# EAGLE design esp8266-dev-board (EAGLE 7.3.0)

## Sheet 1 of 2
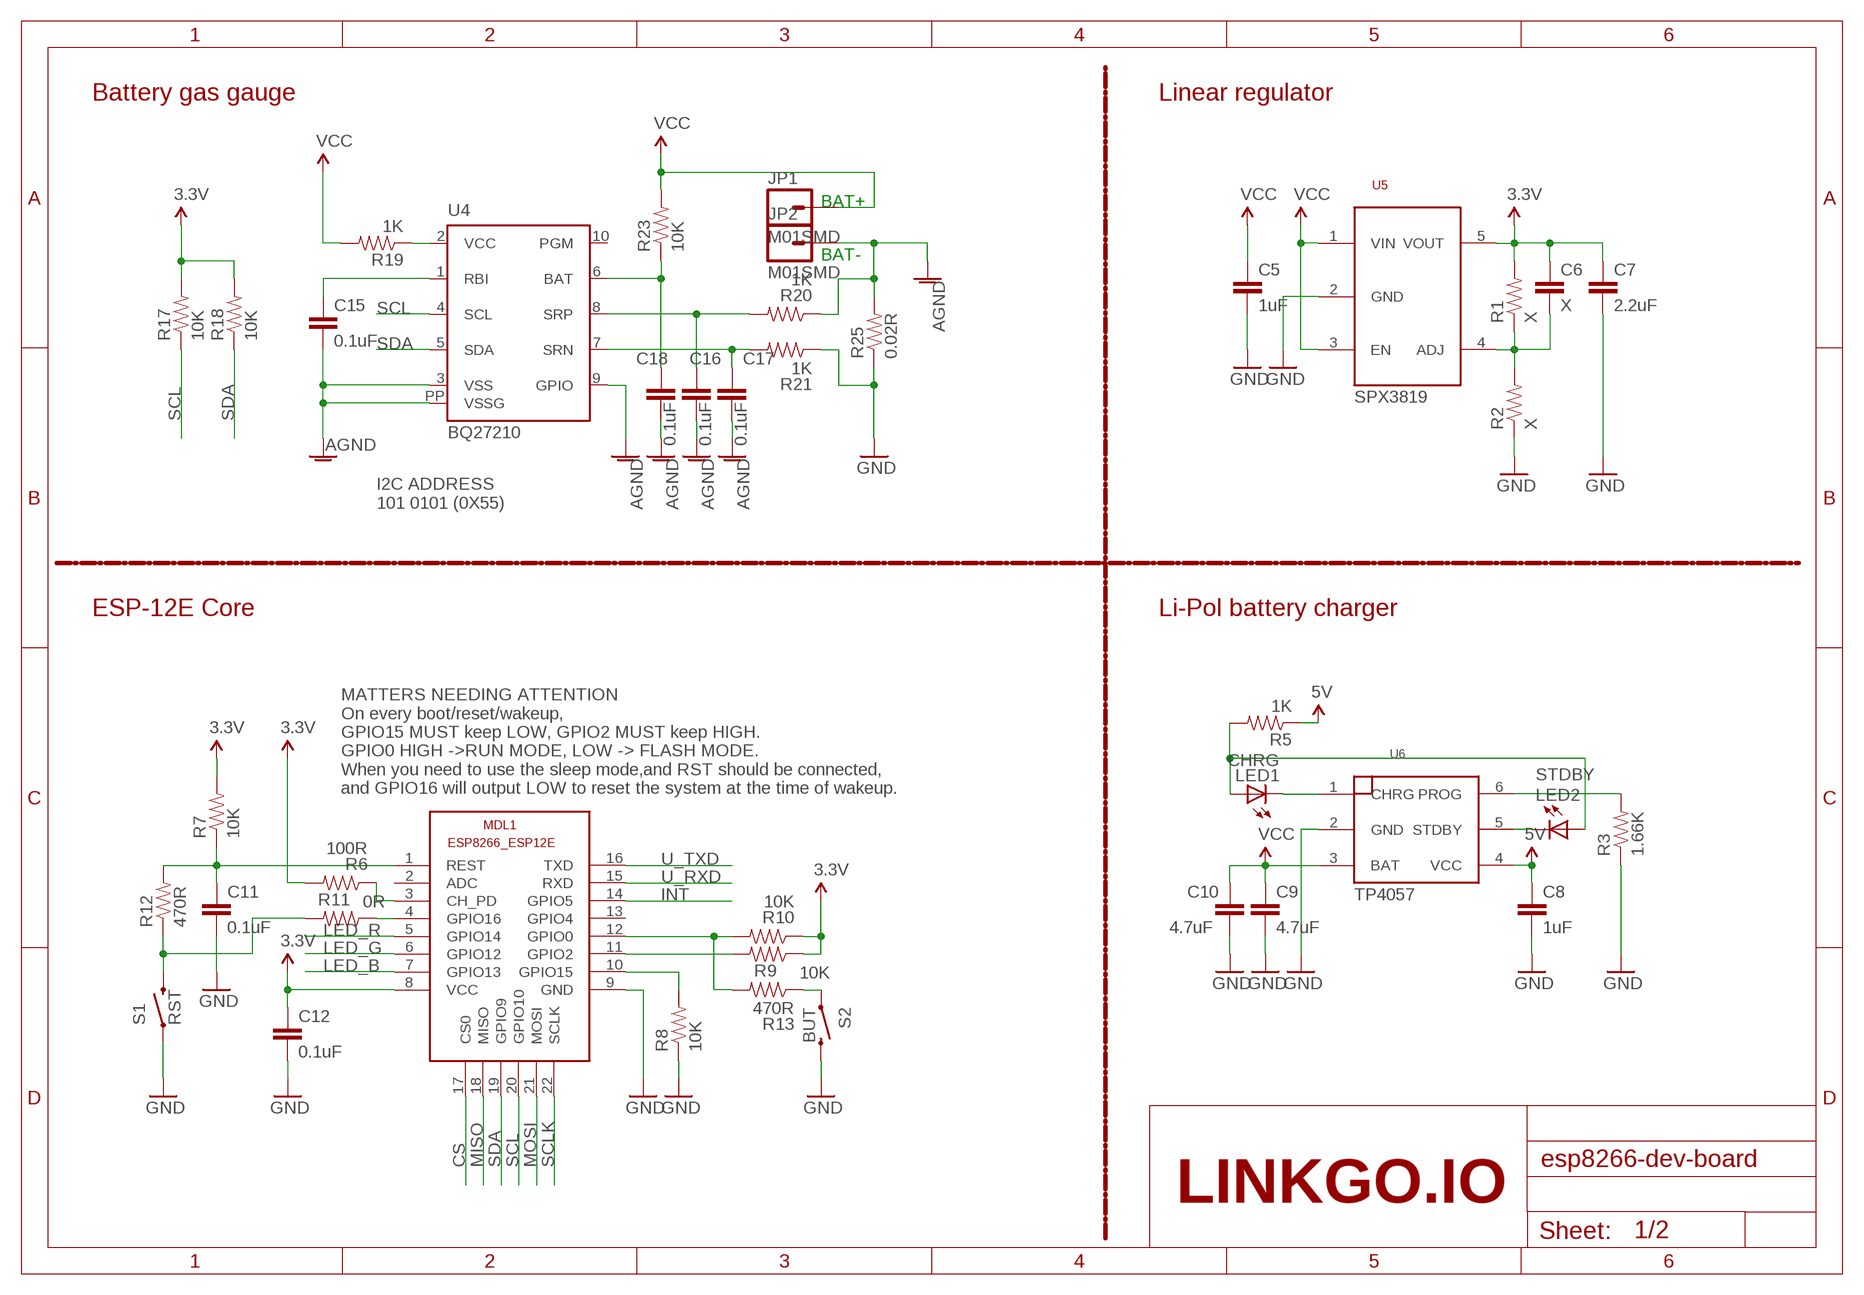
[diagram p0: schematic, sheet 1]

### Parts
C5  1uF  0.1UF-25V(+80/-20%)(0603)  [0603-CAP]
C6  X  0.1UF-25V(+80/-20%)(0603)  [0603-CAP]
C7  2.2uF  0.1UF-25V(+80/-20%)(0603)  [0603-CAP]
C8  1uF  0.1UF-25V(+80/-20%)(0603)  [0603-CAP]
C9  4.7uF  0.1UF-25V(+80/-20%)(0603)  [0603-CAP]
C10  4.7uF  0.1UF-25V(+80/-20%)(0603)  [0603-CAP]
C11  0.1uF  0.1UF-25V(+80/-20%)(0603)  [0603-CAP]
C12  0.1uF  0.1UF-25V(+80/-20%)(0603)  [0603-CAP]
C15  0.1uF  0.1UF-25V(+80/-20%)(0603)  [0603-CAP]
C16  0.1uF  0.1UF-25V(+80/-20%)(0603)  [0603-CAP]
C17  0.1uF  0.1UF-25V(+80/-20%)(0603)  [0603-CAP]
C18  0.1uF  0.1UF-25V(+80/-20%)(0603)  [0603-CAP]
JP1  M01SMD  [LUXEON-PAD]
JP2  M01SMD  [LUXEON-PAD]
LED1  CHRG  LED0603  [LED-0603]
LED2  STDBY  LED0603  [LED-0603]
MDL1  ESP8266-12EESP8266-ESP12E  [ESP8266-ESP12E]
R1  X  10KOHM-1/10W-1%(0603)0603  [0603-RES]
R2  X  10KOHM-1/10W-1%(0603)0603  [0603-RES]
R3  1.66K  10KOHM-1/10W-1%(0603)0603  [0603-RES]
R5  1K  10KOHM-1/10W-1%(0603)0603  [0603-RES]
R6  100R  10KOHM-1/10W-1%(0603)0603  [0603-RES]
R7  10K  10KOHM-1/10W-1%(0603)0603  [0603-RES]
R8  10K  10KOHM-1/10W-1%(0603)0603  [0603-RES]
R9  10K  10KOHM-1/10W-1%(0603)0603  [0603-RES]
R10  10K  10KOHM-1/10W-1%(0603)0603  [0603-RES]
R11  0R  10KOHM-1/10W-1%(0603)0603  [0603-RES]
R12  470R  10KOHM-1/10W-1%(0603)0603  [0603-RES]
R13  470R  10KOHM-1/10W-1%(0603)0603  [0603-RES]
R17  10K  10KOHM-1/10W-1%(0603)0603  [0603-RES]
R18  10K  10KOHM-1/10W-1%(0603)0603  [0603-RES]
R19  1K  10KOHM-1/10W-1%(0603)0603  [0603-RES]
R20  1K  10KOHM-1/10W-1%(0603)0603  [0603-RES]
R21  1K  10KOHM-1/10W-1%(0603)0603  [0603-RES]
R23  10K  10KOHM-1/10W-1%(0603)0603  [0603-RES]
R25  0.02R  RESISTOR1206  [1206]
S1  RST  SWITCH-MOMENTARY-2-SMD-1101NE  [TACTILE-SWITCH-1101NE]
S2  BUT  SWITCH-MOMENTARY-2-SMD-1101NE  [TACTILE-SWITCH-1101NE]
U4  BQ27210  [DRK_S-PDSO-N10]
U5  SPX3819M5-ADJ  [SOT23-5]
U6  TP4057  [SOT23-6]

### Nets
3.3V: C6.1 C7.1 C12.1 MDL1.8(VCC) R1.2 R6.2 R7.2 R9.1 R10.1 R17.2 R18.2 U5.5(VOUT) ; also sheet 2
5V: C8.1 R5.1 U6.4(VCC) ; also sheet 2
AGND: C15.2 C16.2 C17.2 C18.2 JP2.P$1 R20.1 R25.2 U4.3(VSS) U4.9(GPIO) U4.PP(VSSG)
CS: MDL1.17(CS0) ; also sheet 2
GND: C5.2 C7.2 C8.2 C9.2 C10.2 C11.2 C12.2 MDL1.9(GND) R2.1 R3.1 R8.1 R21.1 R25.1 S1.P$1 S2.P$2 U5.2(GND) U6.2(GND) ; also sheet 2
INT: MDL1.14(GPIO5) ; also sheet 2
LED_B: MDL1.7(GPIO13) ; also sheet 2
LED_G: MDL1.6(GPIO12) ; also sheet 2
LED_R: MDL1.5(GPIO14) ; also sheet 2
MISO: MDL1.18(MISO) ; also sheet 2
MOSI: MDL1.21(MOSI) ; also sheet 2
N$1: C6.2 R1.1 R2.2 U5.4(ADJ)
N$4: MDL1.10(GPIO15) R8.2
N$5: MDL1.12(GPIO0) R10.2 R13.2
N$6: LED1.A LED2.A R5.2
N$7: C11.1 MDL1.1(REST) R7.1 R12.2
N$8: LED1.C U6.1(CHRG)
N$9: LED2.C U6.5(STDBY)
N$10: R3.2 U6.6(PROG)
N$11: MDL1.3(CH_PD) R6.1
N$12: MDL1.11(GPIO2) R9.2
N$13: MDL1.4(GPIO16) R11.1
N$14: R11.2 R12.1 S1.P$2
N$15: R13.1 S2.P$1
N$20: C15.1 U4.1(RBI)
N$21: R19.1 U4.2(VCC)
N$22: C17.1 R21.2 U4.7(SRN)
N$23: C16.1 R20.2 U4.8(SRP)
N$26: C18.1 R23.1 U4.6(BAT)
SCL: MDL1.20(GPIO10) R17.1 U4.4(SCL) ; also sheet 2
SCLK: MDL1.22(SCLK) ; also sheet 2
SDA: MDL1.19(GPIO9) R18.1 U4.5(SDA) ; also sheet 2
U_RXD: MDL1.15(RXD) ; also sheet 2
U_TXD: MDL1.16(TXD) ; also sheet 2
VCC: C5.1 C9.1 C10.1 JP1.P$1 R19.2 R23.2 U5.1(VIN) U5.3(EN) U6.3(BAT)
Unconnected: MDL1.2(ADC) MDL1.13(GPIO4) U4.10(PGM)

### Notes on the sheet
- Battery gas gauge | Linear regulator
- BAT+
- BAT-
- SPX3819
- I2C ADDRESS
  101 0101 (0X55)
- ESP-12E Core | Li-Pol battery charger
- MATTERS NEEDING ATTENTION
  On every boot/reset/wakeup,
  GPIO15 MUST keep LOW, GPIO2 MUST keep HIGH.
  GPIO0 HIGH ->RUN MODE, LOW -> FLASH MODE.
  When you need to use the sleep mode,and RST should be connected, 
  and GPIO16 will output LOW to reset the system at the time of wakeup.
- TP4057
- LINKGO.IO

## Sheet 2 of 2
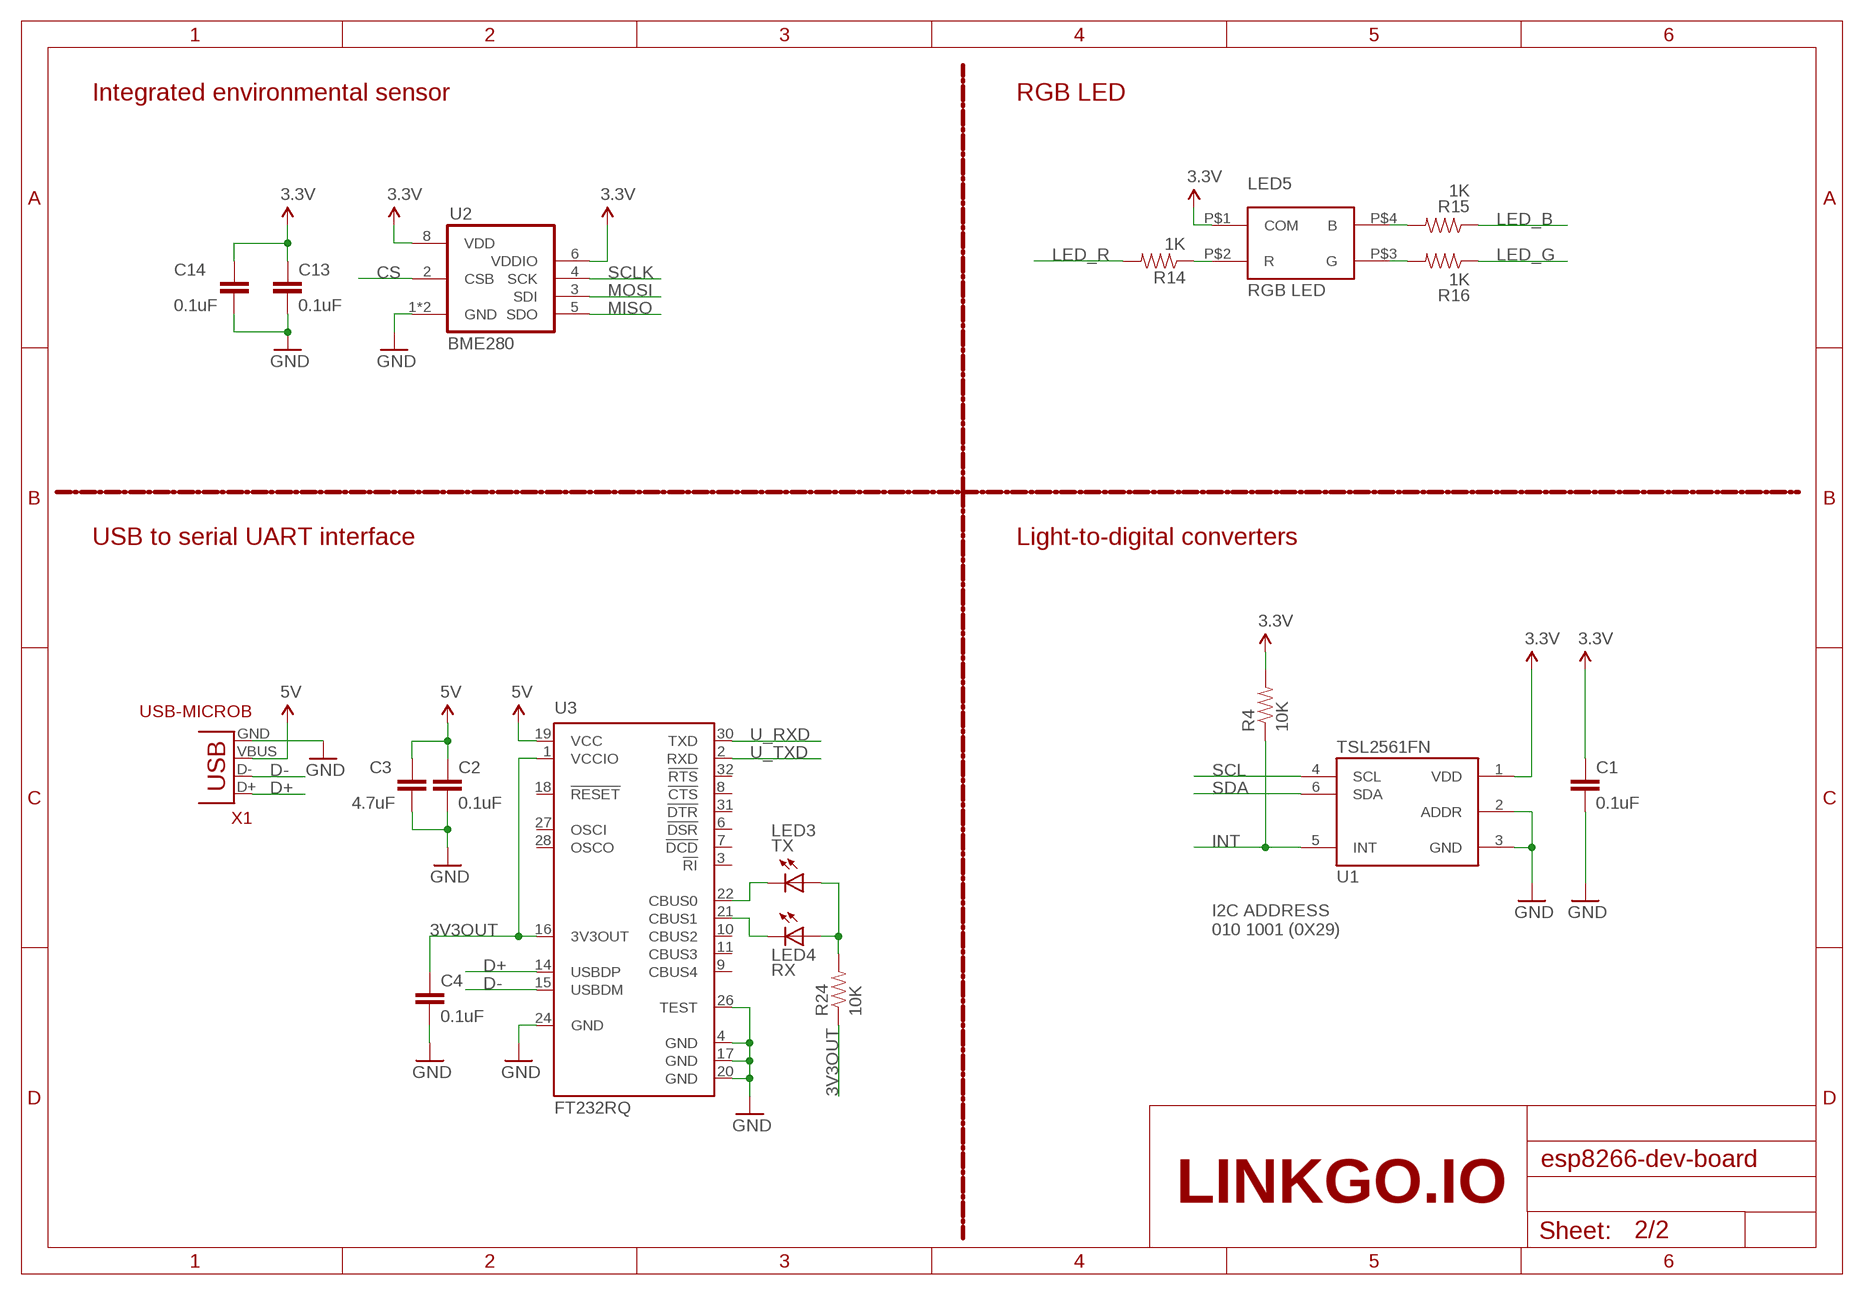
[diagram p1: schematic, sheet 2]

### Parts
C1  0.1uF  0.1UF-25V(+80/-20%)(0603)  [0603-CAP]
C2  0.1uF  0.1UF-25V(+80/-20%)(0603)  [0603-CAP]
C3  4.7uF  0.1UF-25V(+80/-20%)(0603)  [0603-CAP]
C4  0.1uF  0.1UF-25V(+80/-20%)(0603)  [0603-CAP]
C13  0.1uF  0.1UF-25V(+80/-20%)(0603)  [0603-CAP]
C14  0.1uF  0.1UF-25V(+80/-20%)(0603)  [0603-CAP]
LED3  TX  LED0603  [LED-0603]
LED4  RX  LED0603  [LED-0603]
LED5  0603RGB  [0603RGB]
R4  10K  10KOHM-1/10W-1%(0603)0603  [0603-RES]
R14  1K  10KOHM-1/10W-1%(0603)0603  [0603-RES]
R15  1K  10KOHM-1/10W-1%(0603)0603  [0603-RES]
R16  1K  10KOHM-1/10W-1%(0603)0603  [0603-RES]
R24  10K  10KOHM-1/10W-1%(0603)0603  [0603-RES]
U1  TSL2561FN  [FN-6]
U2  BME280  [BME280]
U3  FT232RQ  [QFN32]
X1  USB-MICROB  [USB-MICROB]

### Nets
3.3V: C1.1 C13.1 C14.1 LED5.P$1(COM) R4.2 U1.1(VDD) U2.6(VDDIO) U2.8(VDD) ; also sheet 1
3V3OUT: C4.1 R24.1 U3.1(VCCIO) U3.16(3V3OUT)
5V: C2.1 C3.1 U3.19(VCC) X1.VBUS ; also sheet 1
CS: U2.2(CSB) ; also sheet 1
D+: U3.14(USBDP) X1.D+
D-: U3.15(USBDM) X1.D-
GND: C1.2 C2.2 C3.2 C4.2 C13.2 C14.2 U1.2(ADDR) U1.3(GND) U2.1(GND) U2.7(GND) U3.4(GND) U3.17(GND) U3.20(GND) U3.24(GND) U3.26(TEST) X1.GND ; also sheet 1
INT: R4.1 U1.5(INT) ; also sheet 1
LED_B: R15.1 ; also sheet 1
LED_G: R16.1 ; also sheet 1
LED_R: R14.2 ; also sheet 1
MISO: U2.5(SDO) ; also sheet 1
MOSI: U2.3(SDI) ; also sheet 1
N$2: LED3.C U3.22(CBUS0)
N$3: LED4.C U3.21(CBUS1)
N$16: LED5.P$2(R) R14.1
N$17: LED5.P$4(B) R15.2
N$18: LED5.P$3(G) R16.2
N$19: LED3.A LED4.A R24.2
SCL: U1.4(SCL) ; also sheet 1
SCLK: U2.4(SCK) ; also sheet 1
SDA: U1.6(SDA) ; also sheet 1
U_RXD: U3.30(TXD) ; also sheet 1
U_TXD: U3.2(RXD) ; also sheet 1
Unconnected: U3.3(!RI) U3.6(!DSR) U3.7(!DCD) U3.8(!CTS) U3.9(CBUS4) U3.10(CBUS2) U3.11(CBUS3) U3.18(!RESET) U3.27(OSCI) U3.28(OSCO) U3.31(!DTR) U3.32(!RTS)

### Notes on the sheet
- Integrated environmental sensor | RGB LED
- LED5
- RGB LED
- USB to serial UART interface | Light-to-digital converters
- I2C ADDRESS
  010 1001 (0X29)
- LINKGO.IO

## Power pins joined to a net without a drawn wire
PP: U4.PP@1(PP) U4.PP@2(PP) U4.PP@3(PP) U4.PP@4(PP) U4.PP@5(PP) U4.PP@6(PP) U4.PP@7(PP) U4.PP@8(PP) U4.PP@9(PP) U4.PP@10(PP)

## Library data of the parts
C1 C2 C4 C11-C18 = SparkFun-Capacitors:0.1UF-25V(+80/-20%)(0603): CAP-00810 Ceramic Standard decoupling cap; PROD_ID: CAP-00810
C3 C5-C10 = SparkFun-Capacitors:0.1UF-25V(+80/-20%)(0603): CAP-00810 Ceramic Standard decoupling cap; PROD_ID: CAP-00810; VALUE: 0.1uF
JP1 JP2 = SparkFun:M01: Header 1 Standard 1-pin 0.1" header. Use with straight break away headers (SKU : PRT-00116), right angle break away headers (PRT-00553), swiss pins (PRT-00743), machine pins (PRT-00117), and female headers (PRT-00115).
LED1-LED4 = SparkFun:LED: LEDs Standard schematic elements and footprints for 5mm, 3mm, 1206, and 0603 sized LEDs. 5mm - Spark Fun Electronics SKU : COM-00529 (and others)
LED5 = Sincoheren:0603RGB
MDL1 = linkgo:ESP8266-12E: ESP8266-12E with additional I/O and GPIO04/05 corrected The author cannot warrant that this library is free from error or will meet your specific requirements. Created by PuceBaboon.com. Komagane, Nagano, JAPAN
R1-R3 R5 R6 R11-R16 R19-R21 = SparkFun-Resistors:10KOHM-1/10W-1%(0603): RES-00824; PROD_ID: RES-00824; VALUE: 10K
R4 R7-R10 R17 R18 R23 R24 = SparkFun-Resistors:10KOHM-1/10W-1%(0603): RES-00824; PROD_ID: RES-00824
R25 = SparkFun:RESISTOR: Resistor Basic schematic elements and footprints for 0603, 1206, and PTH 1/10th watt (small) resistors.
S1 S2 = SparkFun:SWITCH-MOMENTARY-2
U1 = SparkFun-DigitalIC:TSL2561: TSL2561 illumination sensor Approximates Human Eye Response Precisely Measures Illuminance Programmable Interrupt Function with User-Defined Upper and Lower Threshold 400 KHz I2C interface Programmable Analog Gain and Integration Time Supporting 1,000,000-to-1 Dynamic Range Automatically Rejects 50/60-Hz Lighting Ripple Low Active Power (0.75 mW Typical) with Power Down Mode RoHS Compliant The TSL2561 is a light-to-digital converter that transform light intensity to a digital signal output via I2C interface. The device combines one broadband photodiode (visible plus infrared) and one infrared-responding photodiode on a single CMOS integrated circuit capable of providing a near-photopic response over an effective 20-bit dynamic range (16-bit resolution). Two integrating ADCs convert the photodiode currents to a digital output that represents the irradiance measured on each channel. This digital output can be input to a microprocessor where illuminance (ambient light level) in lux is derived using an empirical formula to approximate the human eye response. The TSL2561 device supports a traditional level style interrupt that remains asserted until the firmware clears it.; PROD_ID: IC-11791
U2 = linkgo:BME280: DIGITAL HUMIDITY, PRESSURE AND TEMPERATURE SENSOR * Digital interface I²C (up to 3.4 MHz) and SPI (3 and 4 wire, up to 10 MHz)* Supply voltage VDD main supply voltage range: 1.71 V to 3.6 V*VDDIO interface voltage range: 1.2 V to 3.6 V Operating range -40…+85 °C, 0…100 % rel. humidity, 300…1100 hPa The library has been designed by Richard Magdycz <https://www.facebook.com/groups/eaglecadsoftUK>
U3 = ftdichip:FT232R: Source: http://www.ftdichip.com/Documents/DataSheets/DS_FT232R_v104.pdf; MPN: FT232RQ; OC_FARNELL: 1146033; OC_NEWARK: 91K9919
U4 = texas:BQ27210: Li-Ion AND Li-Pol BATTERY GAS GAUGE IC FOR PORTABLE APPLICATIONS I2C Communication (bqJUNIOR) Source: www.ti.com .. bq27010.pdf; MPN: BQ27210DRKR; OC_FARNELL: 1534540; OC_NEWARK: 30M3431
U5 = Sincoheren:SPX3819M5
U6 = linkgo:TP4057
X1 = linkgo:USB: USB Connectors USB-B-PTH is fully proven SKU : PRT-00139 USB-miniB is fully proven SKU : PRT-00587 USB-A-PCB is untested. USB-A-H is throughly reviewed, but untested. Spark Fun Electronics SKU : PRT-00437 USB-B-SMT is throughly reviewed, but untested. Needs silkscreen touching up. USB-A-S has not been used/tested USB-MB-H has not been used/tested

## Board
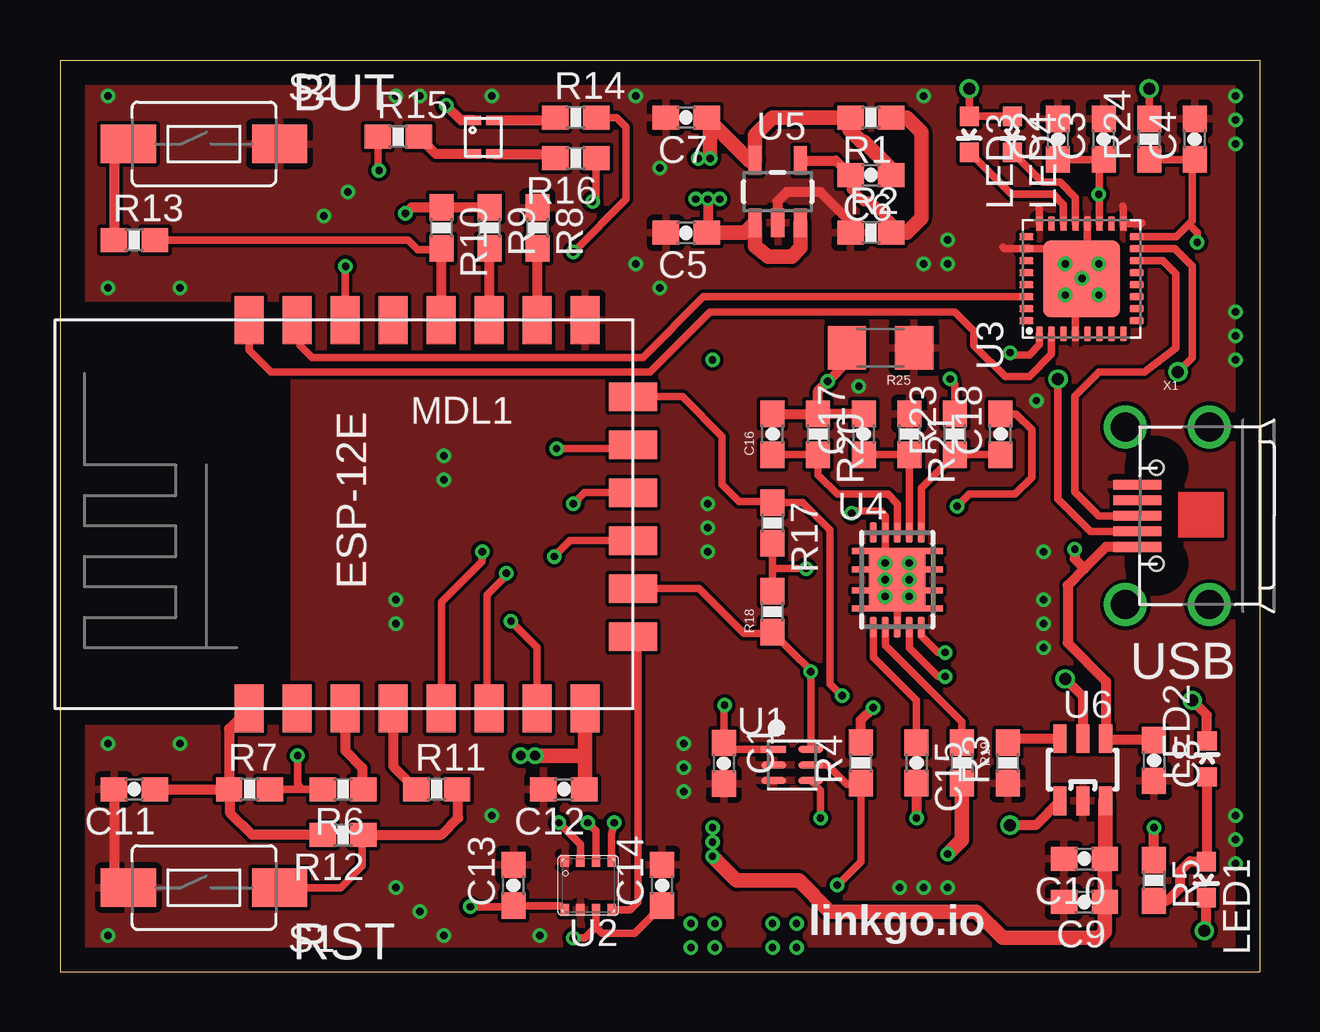
[diagram p2: board, top side]
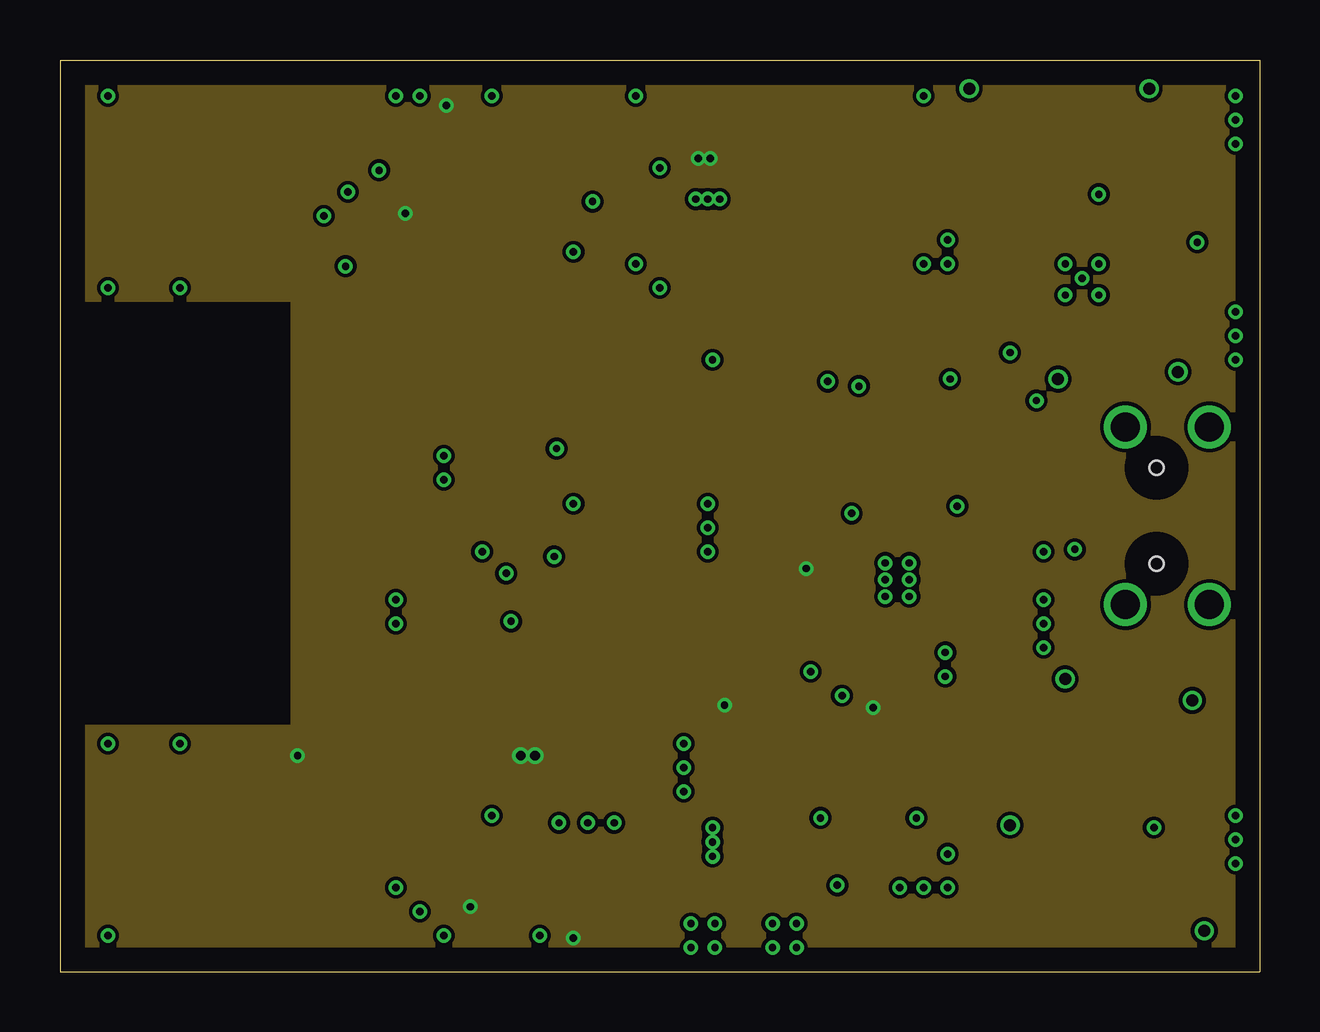
[diagram p3: board, inner layer Route2]
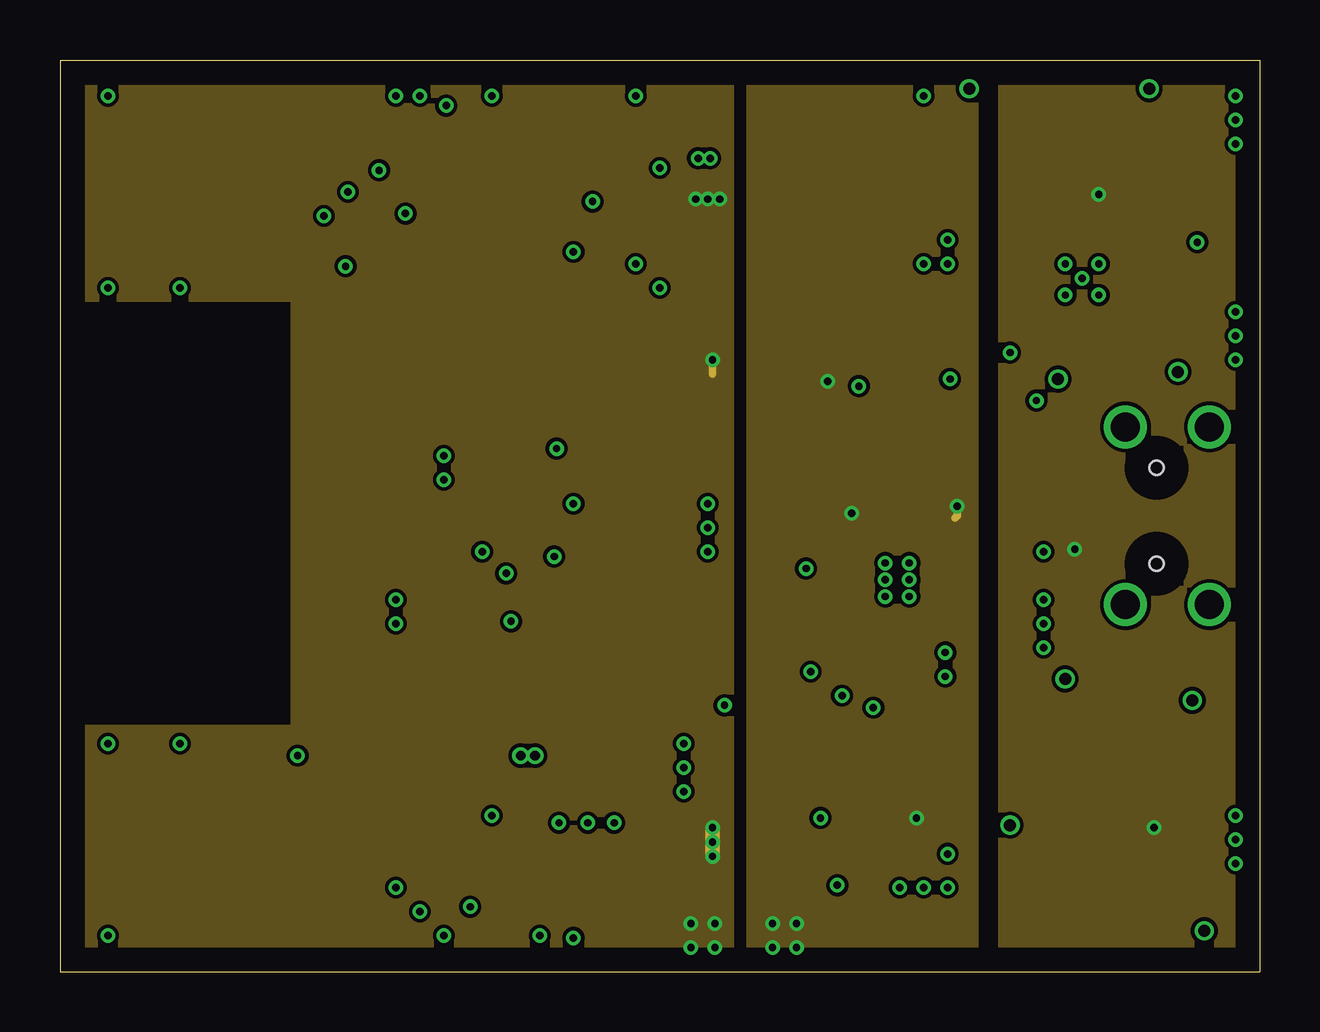
[diagram p4: board, inner layer Route15]
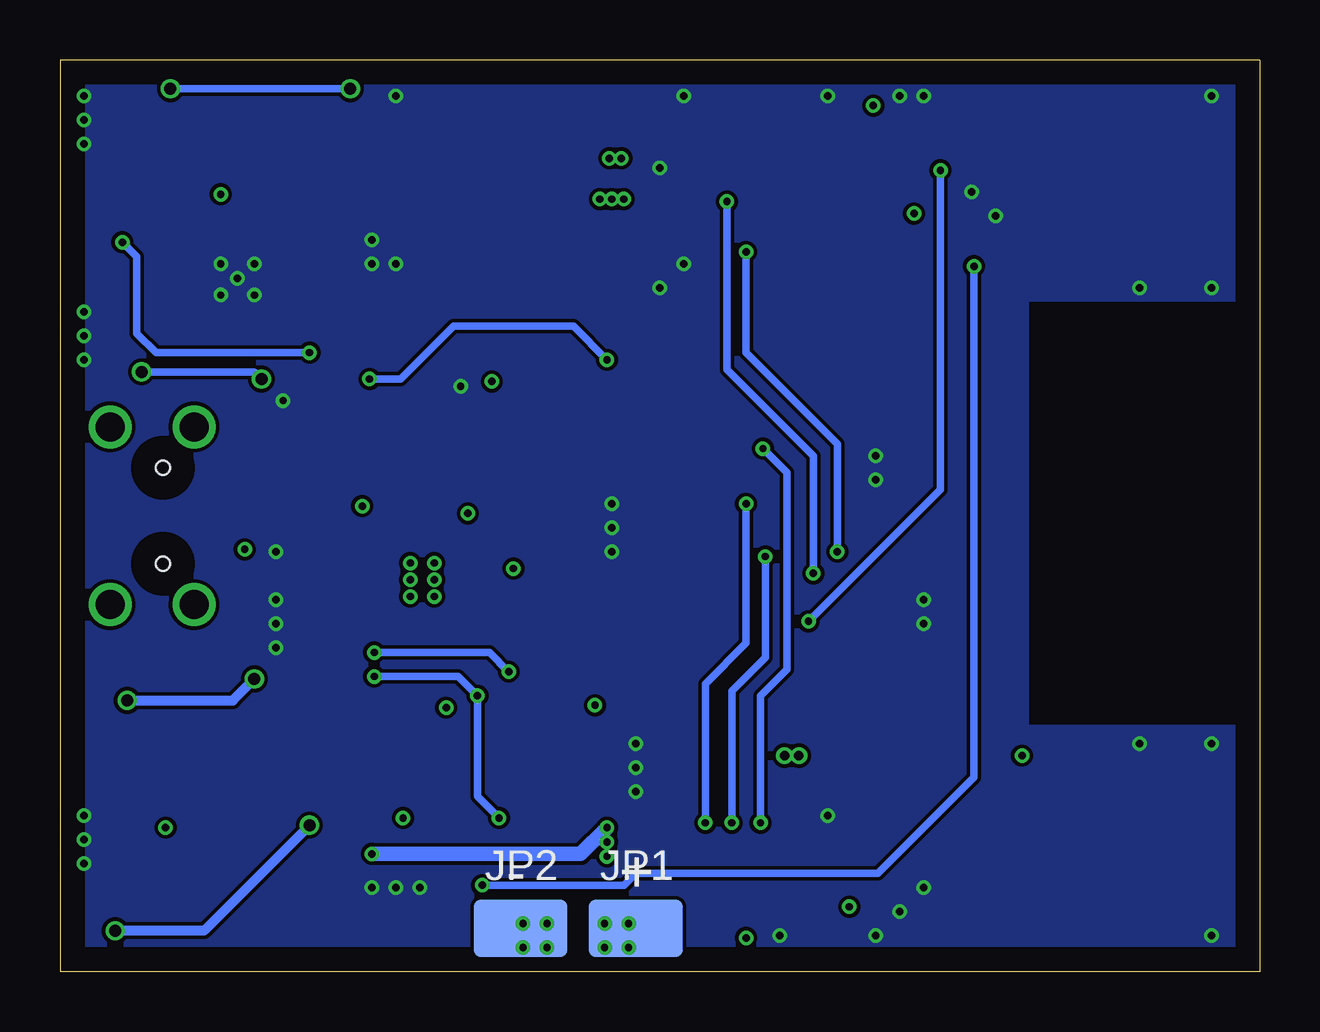
[diagram p5: board, bottom side, seen from below]

Size 50 x 38 mm. Coordinates in mm from the lower left corner, seen from the top.
Outline: 0,0 50,0 50,38 0,38 0,0
Copper layers (1*2+15*16): Top 0.035mm / dielectric 0.3mm / Route2 0.017mm / dielectric 0.3mm / Route15 0.035mm / dielectric 0.2mm / Bottom 0.017mm
Design rules "jlc *": minimum track width 6mil, minimum drill 0.3mm, track to track 6mil, track to pad 6mil, pad to pad 6mil, via to via 6mil, smd to smd 6mil, copper to edge 40mil, drill to drill 8mil, minimum pad ring 6mil, minimum via ring 6mil, stop-mask expansion 4mil, vias tented up to drill 20mil, thermal gap 10mil

### Footprints (pad centres in the part's own frame; a part is rotated, then mirrored left to right if it is on the bottom)
0603-CAP = smd 1.1 x 1: 1 -0.85,0; 2 0.85,0
LUXEON-PAD = smd 3.9 x 2.4: P$1 0,0
LED-0603 = smd 0.8 x 0.8: A 0,-0.75; C 0,0.75
0603RGB = smd 0.6 x 0.4: P$1 0.35,1.5; P$2 1.15,1.5; P$3 1.15,0.1; P$4 0.35,0.1
ESP8266-ESP12E = smd 2 x 1.2: 1 0,16; 2 0,14; 3 0,12; 4 0,10; 5 0,8; 6 0,6; 7 0,4; 8 0,2; 9 16.2,2; 10 16.2,4; 11 16.2,6; 12 16.2,8; 13 16.2,10; 14 16.2,12; 15 16.2,14; 16 16.2,16 | smd 1.2 x 2: 17 11,0; 18 3,0; 19 5,0; 20 13,0; 21 7,0; 22 9,0
0603-RES = smd 1.1 x 1: 1 -0.85,0; 2 0.85,0
1206 = smd 1.6 x 1.8: 1 -1.4,0; 2 1.4,0
TACTILE-SWITCH-1101NE = smd 2.3 x 1.6: P$1 -3.15,0; P$2 3.15,0
FN-6 = smd 1.05 x 0.3: 1 -0.775,0.65; 2 -0.775,0; 3 -0.775,-0.65; 4 0.775,-0.65; 5 0.775,0; 6 0.775,0.65
BME280 = smd 0.35 x 0.5: 1 0.975,-1.025; 2 0.325,-1.025; 3 -0.325,-1.025; 4 -0.975,-1.025; 5 -0.975,1.025; 6 -0.325,1.025; 7 0.325,1.025; 8 0.975,1.025
QFN32 = smd 0.6 x 0.3: 1 -2.3,1.75; 2 -2.3,1.25; 3 -2.3,0.75; 4 -2.3,0.25; 5 -2.3,-0.25; 6 -2.3,-0.75; 7 -2.3,-1.25; 8 -2.3,-1.75; 17 2.3,-1.75; 18 2.3,-1.25; 19 2.3,-0.75; 20 2.3,-0.25; 21 2.3,0.25; 22 2.3,0.75; 23 2.3,1.25; 24 2.3,1.75 | smd 0.3 x 0.6: 9 -1.75,-2.3; 10 -1.25,-2.3; 11 -0.75,-2.3; 12 -0.25,-2.3; 13 0.25,-2.3; 14 0.75,-2.3; 15 1.25,-2.3; 16 1.75,-2.3; 25 1.75,2.3; 26 1.25,2.3; 27 0.75,2.3; 28 0.25,2.3; 29 -0.25,2.3; 30 -0.75,2.3; 31 -1.25,2.3; 32 -1.75,2.3 | smd 3.2 x 3.2: EXP 0,0
DRK_S-PDSO-N10 = smd 0.28 x 0.85: 1 -1,-1.975; 2 -0.5,-1.975; 3 0,-1.975; 4 0.5,-1.975; 5 1,-1.975; 6 1,1.975; 7 0.5,1.975; 8 0,1.975; 9 -0.5,1.975; 10 -1,1.975 | smd 2.35 x 2.65: PP 0,0 | smd 3.8 x 0.25: PP@1 0,1.2; PP@2 0,0.435; PP@3 0,-0.435; PP@4 0,-1.2 | drill 0.3 pad 0.5: PP@5 -0.5,0.7; PP@6 0.5,0.7; PP@7 -0.5,0; PP@8 0.5,0; PP@9 -0.5,-0.7; PP@10 0.5,-0.7
SOT23-5 = smd 0.55 x 1.2: 1 -0.95,-1.3; 2 0,-1.3; 3 0.95,-1.3; 4 0.95,1.3; 5 -0.95,1.3
SOT23-6 = smd 0.55 x 1.2: 1 -0.95,-1.3; 2 0,-1.3; 3 0.95,-1.3; 4 0.95,1.3; 5 0,1.3; 6 -0.95,1.3
USB-MICROB = smd 0.4 x 2: D+ 0,3.1; D- -0.65,3.1; GND 1.3,3.1; ID 0.65,3.1; VBUS -1.3,3.1 | drill 1.2: P$1 3.7,0.1; P$2 -3.7,0.1; P$3 3.7,3.6; P$4 -3.7,3.6 | hole 0.6: -2,2.3; 2,2.3

### Placement (x,y rotation side)
C1  27.67,8.68 270 top
C2  41.6,34.7 90 top
C3  43.5,34.7 90 top
C4  47.3,34.7 90 top
C5  26.1,30.8 180 top
C6  33.8,33.2 180 top
C7  26.1,35.6 180 top
C8  45.6,8.8 270 top
C9  42.7,2.9 180 top
C10  42.7,4.7 180 top
C11  3.1,7.6 180 top
C12  21,7.6 180 top
C13  18.9,3.6 90 top
C14  25.1,3.6 90 top
C15  35.7,8.7 270 top
C16  29.7,22.4 90 top
C17  33.5,22.4 90 top
C18  39.2,22.4 90 top
JP1  26,1.8 0 bottom
JP2  30.8,1.8 0 bottom
LED1  47.78,3.83 180 top
LED2  47.81,8.87 0 top
LED3  37.9,34.9 180 top
LED4  39.7,34.9 180 top
LED5  16.9,33.98 0 top
MDL1  23.89,10.96 90 top
R1  33.8,35.6 180 top
R2  33.8,30.8 0 top
R3  39.5,8.7 90 top
R4  33.38,8.7 90 top
R5  45.6,3.8 270 top
R6  11.8,7.6 180 top
R7  7.9,7.6 0 top
R8  19.9,31 270 top
R9  17.9,31 270 top
R10  15.9,31 270 top
R11  15.7,7.6 0 top
R12  11.8,5.7 180 top
R13  3.1,30.5 0 top
R14  21.5,35.6 0 top
R15  14.1,34.8 0 top
R16  21.5,33.9 180 top
R17  29.7,18.7 270 top
R18  29.7,15 90 top
R19  37.6,8.7 270 top
R20  31.6,22.4 270 top
R21  35.4,22.4 270 top
R23  37.3,22.4 90 top
R24  45.4,34.7 90 top
R25  34.2,26 180 top
S1  6,3.5 0 top
S2  6,34.5 0 top
U1  30.52,8.61 0 top
U2  22.02,3.59 180 top
U3  42.58,28.88 90 top
U4  34.9,16.33 0 top
U5  29.92,32.51 0 top
U6  42.63,8.41 0 top
X1  48.01,19 90 top

### Tracks (layer width: path | path; a pad name or v marks a point on that pad's centre or on a via)
3.3V  (via drill 0.3, 0.4)
  Top 0.305: U1.1 27.94,9.26 C1.1 27.67,11.07 v27.7,11.1 | U2.8 20.86,2.75 C13.1 18.85,2.7 v17.1,2.7 | U2.6 22.34,1.85 | 22.34,1.85 22.6,1.6 23.95,1.6 C14.1 | R7.2 10.1,7.6 | 10.1,7.6 R6.2 | v9.9,9 9.9,7.8 10.1,7.6 | R17.2 29.7,16.7 | 29.7,16.7 R18.2 | v31.1,16.8 29.8,16.8 29.7,16.7 | v21.4,1.4 21.89,1.4 22.34,1.85
  Top 0.406: 21.89,7.64 C12.1 | LED5.P$1 16.72,35.48 v16.1,36.1 | R9.1 R10.1 14.65,31.85 v14.4,31.6 | R4.2 33.38,10.48 v33.9,11 | C14.1 25.2,2.65
  Top 0.61: MDL1.8 21.89,9 | 21.89,9 21.89,7.64 | C6.1 34.65,33.45 33.5,34.6 33.4,34.6 32.9,35.1 32.9,35.55 R1.2 29.7,35.6 28.97,34.87 U5.5 28.74,33.81 C7.1 27.1,35.45 v27.1,33.9 | v19.8,9 21.89,9
  other vias: 19.2,9 26.6,33.9
  pour Route2: -1,43.8 50.9,43.8 50.9,-5.9 -1,-5.9
3V3OUT  (via drill 0.3)
  Top 0.305: U3.16 46.53,30.63 47.05,31.15 | 47.05,31.15 47.2,31.3 47.2,33.75 C4.1 R24.1 | U3.1 40.83,26.13 40.4,25.7 39.7,25.7 v39.6,25.8 | v47.4,30.4 47.4,30.8 47.05,31.15
  Bottom 0.305: v39.6,25.8 46,25.8 46.8,26.6 46.8,29.8 v47.4,30.4
5V  (via drill 0.3)
  Top 0.305: C2.1 C3.1 43.33,33.68 U3.19 43.33,32.37 v43.3,32.4
  Top 0.406: X1.VBUS 43.6,17.7 42.7,16.8 | 42.7,16.8 42,16.1 42,13.7 43.6,12.1 43.6,9.73 U6.4 43.64,9.65 C8.1 | v42.3,17.6 42.3,17.2 42.7,16.8 | R5.1 v45.6,6
  pour Route15: 51.3,44.1 39.3,44.1 39.3,-6.3 51.3,-6.3
AGND  (via drill 0.3)
  Top 0.305: v33,19.1 33.1,19.2 34.2,19.2 34.4,19 U4.9 34.4,16.83 U4.PP U4.3 | C18.2 39.85,23.25 40.5,22.6 40.5,20.6 39.8,19.9 37.9,19.9 v37.4,19.4
  Top 0.406: C15.2 v35.7,6.4 | C17.2 R20.1 | R20.1 31.6,24.2 v32,24.6 32.8,25.4 R25.2 | C16.2 R20.1
  Route15 0.305: v37.4,19.4 37.4,19 37.3,18.9
  Bottom 0.406: v30.7,2 30.8,2 JP2.P$1
  other vias: 29.7,2 29.7,1 30.7,1
  pour Route15: 38.1,44.1 28.8,44.1 28.8,-6.3 38.1,-6.3
CS  (via drill 0.3)
  Top 0.305: U2.2 21.7,5.3 v20.8,6.2 | v20.7,21.8 23.73,21.8 MDL1.17
  Bottom 0.305: v20.8,6.2 20.8,11.5 19.7,12.6 19.7,20.8 v20.7,21.8
D+
  Top 0.305: X1.D+ 43.3,19 42.3,20 42.3,24 43.3,25 45.2,25 46.5,26 46.5,29.1 45.97,29.63 U3.14
D-  (via drill 0.5)
  Top 0.305: X1.D- 42.95,18.35 41.6,19.7 v41.6,24.7 | U3.15 46.47,30.13 47.2,29.4 47.2,25.6 v46.6,25
  Bottom 0.305: v46.6,25 41.9,25 v41.6,24.7
GND  (via drill 0.3)
  Top 0.305: U3.24 40.83,31.77 40.8,31.8 | 39.3,30.2 39.37,30.13 U3.26 42.3,30.13 | 44.3,31.9 44.33,31.87 U3.17 45.08,31.18 45.1,31.2 | 42.3,30.13 42.73,30.13 42.83,30.23 U3.20 | U3.4 42.33,30.1 42.3,30.13
  Top 0.406: C11.2 2.25,4.1 S1.P$1 | R2.1 32.95,31.25 31.7,32.5 30.3,32.5 29.9,32.1 29.92,32.08 U5.2
  other vias: 14,3.5 41.9,29.5 43.3,29.5 43.3,28.2 41.9,28.2 42.6,28.9 15,2.5 16,1.5 5,9.5 2,9.5 2,1.5 20,1.5 41,13.5 41,14.5 41,15.5 49,26.5 49,27.5 49,25.5 49,4.5 49,5.5 49,6.5 49,36.5 49,34.5 49,35.5 37,29.5 37,30.5 36,36.5 24,36.5 25,33.5 25,28.5 24,29.5 2,36.5 15,36.5 14,36.5 18,36.5 12,32.5 11,31.5 5,28.5 2,28.5 14,14.5 14,15.5 16,20.5 16,21.5 26,7.5 26,8.5 27,17.5 27,18.5 35,3.5 36,3.5 37,3.5 36,29.5 26,9.5 27,19.5 18,6.5 40.7,23.8 41,17.5 33.3,24.4
  pour Bottom: -0.3,43.2 50.3,43.2 50.3,-5.3 -0.3,-5.3
  pour Top: -0.7,43.5 50.6,43.5 50.6,-5.6 -0.7,-5.6
INT  (via drill 0.3)
  Top 0.305: U1.5 31.99,8.61 32.8,7.8 33.33,7.8 R4.1 33.38,4.58 v32.4,3.6 | MDL1.14 v11.89,29.39 v11.9,29.4
  Bottom 0.305: v11.9,29.4 11.9,8.1 15.9,4.1 26,4.1 26.5,3.6 v32.4,3.6
LED_B  (via drill 0.3)
  Top 0.305: R15.1 13.25,33.45 v13.3,33.4 | v18.8,14.6 19.89,13.51 MDL1.7
  Bottom 0.305: v13.3,33.4 13.3,20.1 v18.8,14.6
LED_G  (via drill 0.3)
  Top 0.305: R16.1 22.35,32.25 v22.2,32.1 | v18.6,16.6 18.6,16.5 17.8,15.7 17.8,11.05 MDL1.6
  Bottom 0.305: v22.2,32.1 22.2,25.1 18.6,21.5 v18.6,16.6
LED_R  (via drill 0.3)
  Top 0.305: R14.2 23.2,35.6 23.6,35.2 23.6,32.2 v21.4,30 | v17.6,17.5 17.6,17.1 15.9,15.4 MDL1.5
  Bottom 0.305: v21.4,30 21.4,25.8 17.6,22 v17.6,17.5
MISO
  Top 0.305: U2.5 23.77,2.56 24.1,2.9 24.1,13.75 MDL1.18
MOSI  (via drill 0.3)
  Top 0.305: U2.3 22.34,5.86 v22,6.2 | v20.6,17.3 21.26,17.96 MDL1.21
  Bottom 0.305: v22,6.2 22,11.7 20.6,13.1 v20.6,17.3
N$1
  Top 0.406: U5.4 32.34,33.81 C6.2 33,33.15 33,32.6 33.5,32.1 33.8,32.1 34.65,31.25 R2.2
  Top 0.61: R1.1 35.3,35.6 35.9,35 35.9,31.4 35.3,30.8 R2.2
N$2
  Top 0.305: U3.22 41.83,31.97 41.4,32.4 39.65,32.4 LED3.C
N$3
  Top 0.305: U3.21 42.33,32.27 41.7,32.9 40.95,32.9 LED4.C
N$4
  Top 0.406: MDL1.10 R8.2
N$5
  Top 0.305: R13.2 14.5,30.5 14.9,30.1 15.85,30.1 R10.2
  Top 0.406: MDL1.12 R10.2
N$6
  Top 0.406: LED2.A 47.81,4.61 LED1.A 47.76,4.6 47.1,4.6 46.7,4.2 46.7,3.5 46.15,2.95 R5.2
N$7
  Top 0.406: MDL1.1 7.05,10.12 R7.1 | C11.1 R7.1 | R12.2 8,5.7 7.1,6.6 7.1,7.55 R7.1
N$8  (via drill 0.5)
  Top 0.406: U6.1 40.67,6.1 v39.6,6.1 | v47.7,1.7 47.78,1.78 LED1.C
  Bottom 0.406: v39.6,6.1 44,1.7 v47.7,1.7
N$9  (via drill 0.5)
  Top 0.406: LED2.C 47.81,10.69 v47.2,11.3 | v41.9,12.2 42.63,11.47 U6.5
  Bottom 0.406: v47.2,11.3 42.8,11.3 v41.9,12.2
N$10
  Top 0.406: R3.2 39.66,9.71 U6.6
N$11
  Top 0.406: MDL1.3 11.89,9.21 12.6,8.5 12.6,7.65 R6.1
N$12
  Top 0.406: MDL1.11 R9.2
N$13
  Top 0.406: MDL1.4 13.89,8.56 R11.1
N$14
  Top 0.305: S1.P$2 11.7,3.5 12.6,4.4 12.6,5.65 R12.1
  Top 0.406: R12.1 15.9,5.7 16.6,6.4 16.6,7.55 R11.2
N$15
  Top 0.406: S2.P$1 2.25,33.9 R13.1
N$16
  Top 0.406: LED5.P$2 20.53,35.48 R14.1
N$17
  Top 0.406: LED5.P$4 15.67,34.08 R15.2
N$18
  Top 0.406: LED5.P$3 20.47,34.08 R16.2
N$19  (via drill 0.5)
  Top 0.305: R24.2 v45.4,36.8 | LED4.A LED3.A v37.9,36.8
  Bottom 0.305: v45.4,36.8 v37.9,36.8
N$20
  Top 0.305: U4.1 33.9,13.1 35.7,11.3 C15.1
N$21
  Top 0.305: U4.2 34.4,13.6 37.6,10.4 R19.1
N$22
  Top 0.305: U4.7 R21.2 C17.1
N$23
  Top 0.305: U4.8 34.9,19.5 34.5,19.9 32.4,19.9 31.6,20.7 R20.2 C16.1
N$24
  cutout Top: 29.5,8.7 30.2,8.7 30.2,8 29.5,8
N$26
  Top 0.305: U4.6 35.9,20.15 R23.1 C18.1
N$30
  cutout Bottom: -0.3,27.9 9.6,27.9 9.6,10.3 -0.3,10.3
N$31
  cutout Route15: -1.3,27.9 9.6,27.9 9.6,10.3 -1.3,10.3
N$32
  cutout Route2: -1,27.9 9.6,27.9 9.6,10.3 -1,10.3
N$33
  cutout Top: -0.7,27.9 9.6,27.9 9.6,10.3 -0.7,10.3
PP
  Top 0.254: 35.16,15.63 35.16,15.39 U4.PP@4 | 34.63,17.03 34.63,17.27 U4.PP@1
  Top 0.305: 35.16,15.63 U4.PP@9 U4.PP@7 U4.PP@5 34.63,17.03 | 34.63,17.03 U4.PP@6 U4.PP@8 | 34.63,17.03 U4.PP@2 | U4.PP@10 35.16,15.63 | 35.16,15.63 U4.PP@3
SCL  (via drill 0.3)
  Top 0.305: MDL1.20 25.94,23.96 27.6,22.3 27.6,20.3 28.3,19.6 29.65,19.6 R17.1 30.95,19.55 32.1,18.4 32.1,12 v32.6,11.5 | v31.7,6.4 31.7,7.56 U1.4 | U4.4 35.4,13.5 36.6,12.3 v36.9,12.3
  Bottom 0.305: v31.7,6.4 32.6,7.3 v32.6,11.5 33.4,12.3 v36.9,12.3
SCLK  (via drill 0.3)
  Top 0.305: U2.4 23,5.7 v23.1,6.2 | v21.4,19.5 21.86,19.96 MDL1.22
  Bottom 0.305: v23.1,6.2 23.1,12 21.4,13.7 v21.4,19.5
SDA  (via drill 0.3)
  Top 0.305: MDL1.19 26.64,15.96 28.5,14.1 29.65,14.1 R18.1 30.48,13.38 31.3,12.55 v31.3,12.5 U1.6 | U4.5 35.9,14 36.6,13.3 v36.9,13.3
  Bottom 0.305: v36.9,13.3 32.09,13.3 v31.3,12.5
U_RXD
  Top 0.305: U3.30 26.83,28.13 24.3,25.6 10.5,25.6 10,26.1 10,27.05 MDL1.15
U_TXD
  Top 0.305: MDL1.16 7.89,25.91 8.8,25 24.6,25 27.1,27.5 37.3,27.5 38.1,26.7 38.1,26.1 39.4,24.8 40.4,24.8 41.33,25.73 U3.2
VCC  (via drill 0.3)
  Top 0.305: R23.2 37.3,24.5 v37.1,24.7
  Top 0.406: v27,32.2 27,30.85 C5.1
  Top 0.61: U6.3 43.58,4.73 C10.1 C9.1 43.55,1.65 43.3,1.4 39.3,1.4 38.2,2.5 32.1,2.5 30.8,3.8 28.2,3.8 v27.2,4.8 | C5.1 28.56,30.8 U5.1 28.97,30.23 29.5,29.8 30.5,29.8 30.87,30.17 U5.3 | R19.2 37.6,5.5 v37,4.9
  Route15 0.305: v27.2,25.5 27.2,24.9
  Route15 0.61: v27.2,6 v27.2,4.8
  Bottom 0.305: v37.1,24.7 35.8,24.7 33.6,26.9 28.6,26.9 v27.2,25.5
  Bottom 0.406: v26.3,1 25.8,1 JP1.P$1
  Bottom 0.61: v37,4.9 28.3,4.9 v27.2,6
  other vias: 27.5,32.2 26.5,32.2 27.2,5.4 27.3,2 27.3,1 26.3,2
  pour Route15: 27.9,44.1 -1.3,44.1 -1.3,-6.2 27.9,-6.2

### Text on the board
tPlace: BUT | USB | linkgo.io | RST
bPlace: + | -